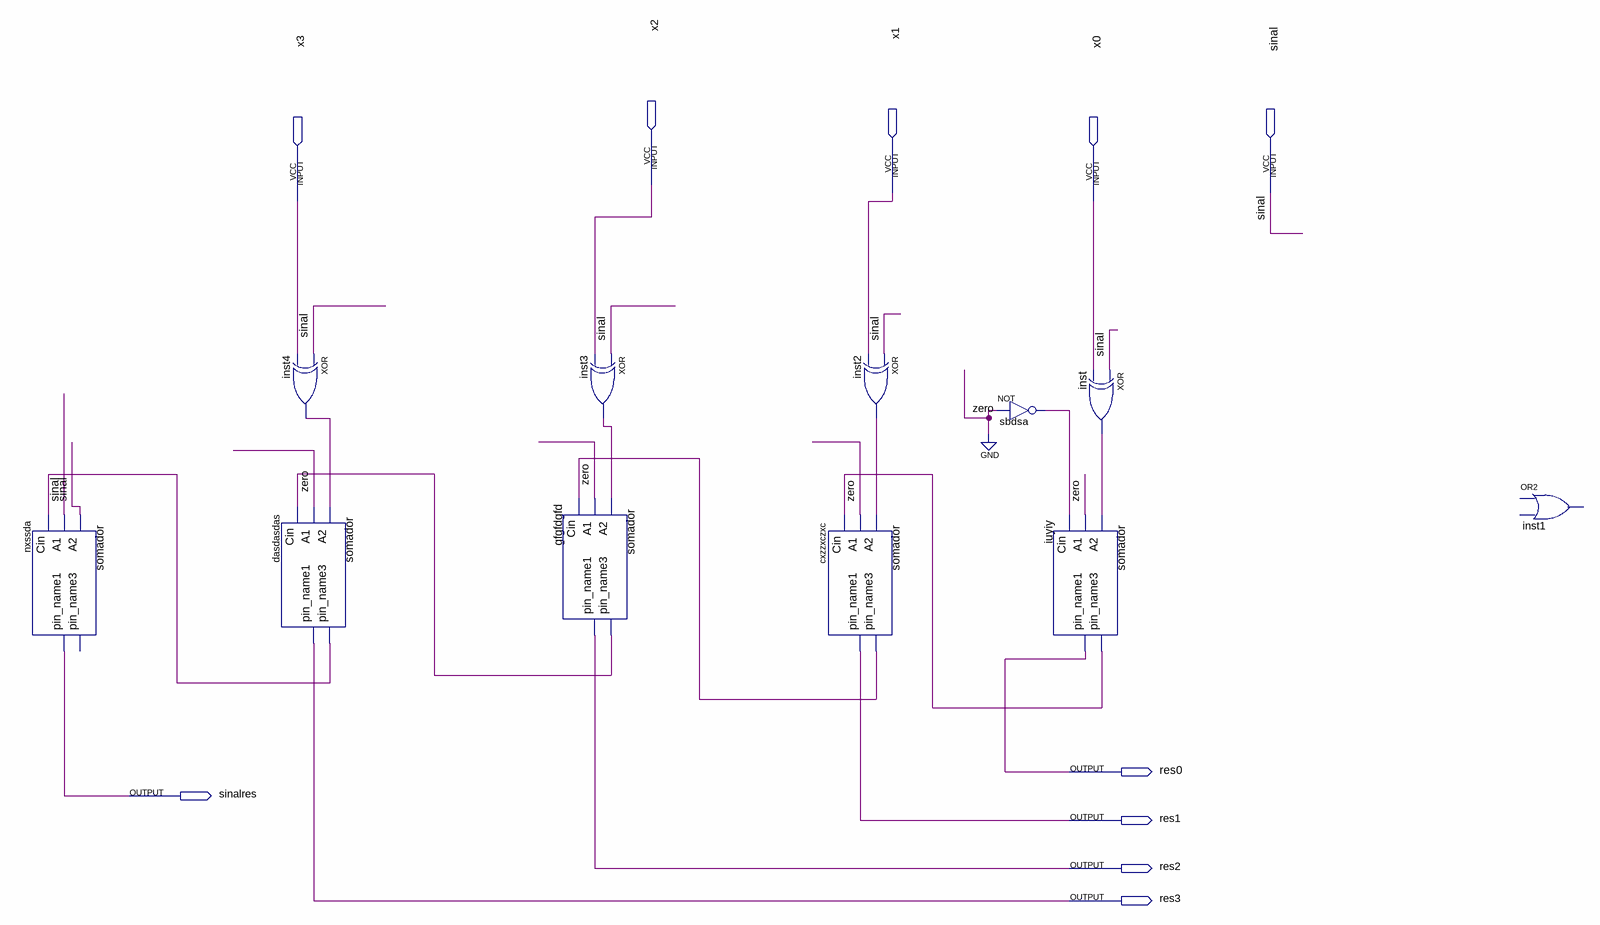
[diagram p0: schematic sheet]
// Quartus schematic complemento.bdf as structural Verilog: 11 symbols, 10 pins
module complemento (
  input  x2,
  input  x1,
  input  sinal,
  input  x3,
  input  x0,
  output res0,
  output sinalres,
  output res1,
  output res2,
  output res3
);

  wire cxzzxczxc_pin_name3, dasdasdas_pin_name3, gfgfdgfd_pin_name3, inst2_out, inst3_out, inst4_out,
       inst_out, iuyiy_pin_name3, sbdsa_out;

  somador nxssda (.A2(sinal), .A1(sinal), .Cin(dasdasdas_pin_name3), .pin_name1(sinalres));  // open: pin_name3
  xor inst4 (inst4_out, sinal, x3);
  somador dasdasdas (
    .A2(inst4_out), .A1(1'b0), .Cin(gfgfdgfd_pin_name3), .pin_name3(dasdasdas_pin_name3), .pin_name1(res3));
  somador gfgfdgfd (
    .A2(inst3_out), .A1(1'b0), .Cin(cxzzxczxc_pin_name3), .pin_name3(gfgfdgfd_pin_name3), .pin_name1(res2));
  xor inst3 (inst3_out, sinal, x2);
  somador cxzzxczxc (
    .A2(inst2_out), .A1(1'b0), .Cin(iuyiy_pin_name3), .pin_name3(cxzzxczxc_pin_name3), .pin_name1(res1));
  xor inst2 (inst2_out, sinal, x1);
  not sbdsa (sbdsa_out, 1'b0);
  xor inst (inst_out, sinal, x0);
  somador iuyiy (.A2(inst_out), .A1(1'b0), .Cin(sbdsa_out), .pin_name3(iuyiy_pin_name3), .pin_name1(res0));
  // OR2 inst1 is placed but not wired
endmodule
